# Altium schematic sheet Button.SchDoc
size A
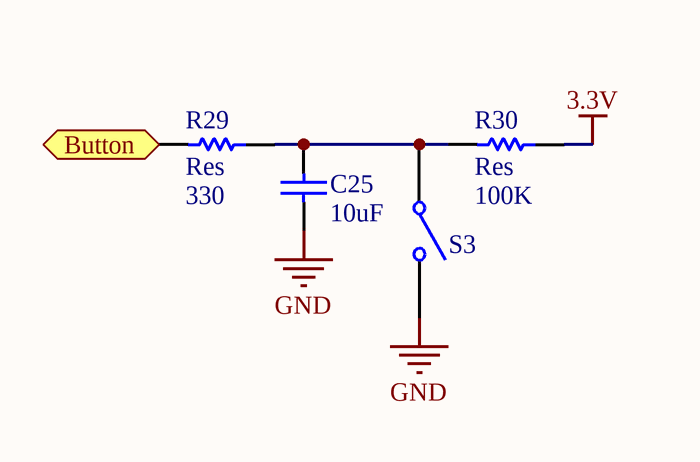
[diagram p0: Button.SchDoc]

## Parts
C25  value 10uF  [2012[0805]]  (hidden comment: Cap_UP)
R29  Res  value 330  [2012[0805]]
R30  Res  value 100K  [2012[0805]]
S3  SW-SPST  [PUSH-BUT]  (value not drawn)

## Ports
Button (out)

## Nets
3.3V: R30.1
GND: C25.1 S3.2(NO)
Button: R29.2 ; port Button
NetC25_2: C25.2 R29.1 R30.2 S3.1(COMMON)

## Library data of the parts
C25 = Cap_UP: Capacitor; Published: 8-Jun-2000; LatestRevisionDate: 17-Jul-2002; LatestRevisionNote: Re-released for DXP Platform.; PackageReference: RAD-0.3; Publisher: Altium Limited
R29 R30 = Res: Semiconductor Resistor; Published: 8-Jun-2000; LatestRevisionDate: 17-Jul-2002; LatestRevisionNote: Re-released for DXP Platform.; PackageReference: AXIAL-0.5; Publisher: Altium Limited
S3 = SW-SPST: Single-Pole, Single-Throw Switch; Published: 24-Mar-1999; Revision: July-2002: Re-released for DXP Platform.; Publisher: Altium Limited